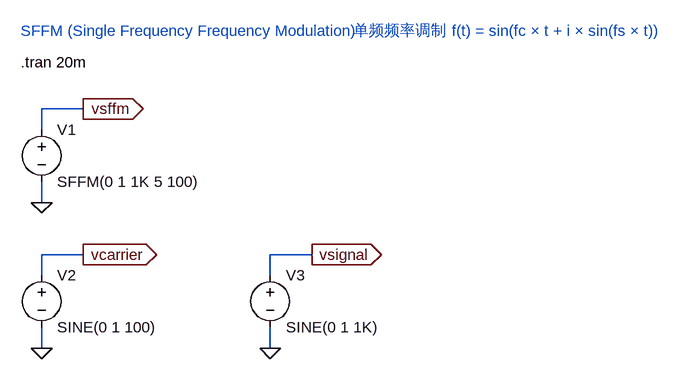
[diagram p0: schematic 07_SFFM.asc]
07_SFFM.asc, the LTspice schematic file:
Version 4
SHEET 1 1352 816
WIRE 432 432 368 432
WIRE 368 464 368 432
WIRE 368 576 368 544
WIRE 432 656 368 656
WIRE 784 656 720 656
WIRE 368 688 368 656
WIRE 720 688 720 656
WIRE 368 800 368 768
WIRE 720 800 720 768
FLAG 368 576 0
FLAG 432 432 vsffm
IOPIN 432 432 Out
FLAG 368 800 0
FLAG 720 800 0
FLAG 432 656 vcarrier
IOPIN 432 656 Out
FLAG 784 656 vsignal
IOPIN 784 656 Out
SYMBOL Voltage 368 448 R0
SYMATTR InstName V1
SYMATTR Value SFFM(0 1 1K 5 100)
SYMBOL Voltage 368 672 R0
SYMATTR InstName V2
SYMATTR Value SINE(0 1 100)
SYMBOL Voltage 720 672 R0
SYMATTR InstName V3
SYMATTR Value SINE(0 1 1K)
TEXT 336 312 Left 2 ;SFFM (Single Frequency Frequency Modulation)
TEXT 336 360 Left 2 !.tran 20m
TEXT 848 312 Left 2 ;单频频率调制
TEXT 1000 312 Left 2 ;f(t) = sin(fc × t + i × sin(fs × t))

The netlist it stands for:
* 07_SFFM.asc
V1 vsffm 0 SFFM(0 1 1K 5 100)
V2 vcarrier 0 SINE(0 1 100)
V3 vsignal 0 SINE(0 1 1K)
* SFFM (Single Frequency Frequency Modulation)
.tran 20m
* 单频频率调制
* f(t) = sin(fc × t + i × sin(fs × t))
.backanno
.end